# Altium schematic sheet 3.9uH power Inductor.schdoc
size 127 x 99 mm
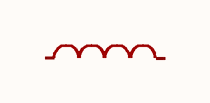
[diagram p0: 3.9uH power Inductor.schdoc]

## Parts
L?  3.9uH  [IND-SMD_L3.0-W3.0_FNR30XXS]  (value not drawn)

## Nets

Not connected (* = marked no-connect by the designer): L? 1 2

## Library data of the parts
L? = FNR3015S3R9MT: Manufacturer: cjiang(长江微电); Add into BOM: yes; Tolerance: ±20%; Saturation Current (Isat): 1.4A; DC Resistance (DCR): 137mΩ; Symbol: FNR3015S3R9MT; Device: FNR3015S3R9MT; LCSC Part Name: 3.9uH ±20% 1.4A; Supplier Part: C167751; Manufacturer Part: FNR3015S3R9MT; Supplier Footprint: SMD,3x3mm; JLCPCB Part Class: Extended Part; Datasheet: https://atta.szlcsc.com/upload/public/pdf/source/20190327/C167925_9EFF0AABC4CA629C2CC95961DBF7D39D.pdf; Supplier: LCSC; Convert to PCB: yes; Value: 3.9uH